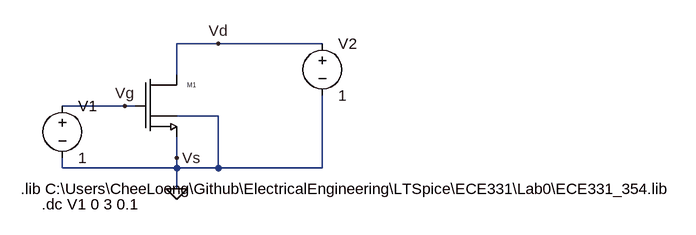
[diagram p0: schematic Lab0transistor.asc]
Lab0transistor.asc, the LTspice schematic file:
Version 4
SHEET 1 1120 680
WIRE 224 64 160 64
WIRE 384 64 224 64
WIRE 160 112 160 64
WIRE 80 160 -16 160
WIRE 96 160 80 160
WIRE 224 176 160 176
WIRE 160 240 160 208
WIRE -16 256 -16 240
WIRE 160 256 160 240
WIRE 160 256 -16 256
WIRE 224 256 224 176
WIRE 224 256 160 256
WIRE 384 256 384 144
WIRE 384 256 224 256
WIRE 160 288 160 256
FLAG 160 288 0
FLAG 224 64 Vd
FLAG 160 240 Vs
FLAG 80 160 Vg
SYMBOL ALD1101 96 112 R0
SYMATTR InstName M1
SYMATTR SpiceModel ""
SYMATTR SpiceLine ""
SYMATTR Value ALD1101
SYMATTR Value2 W=1.379e-3 L=1E-6
SYMBOL voltage -16 144 R0
WINDOW 123 0 0 Left 2
WINDOW 39 0 0 Left 2
SYMATTR InstName V1
SYMATTR Value 1
SYMBOL voltage 384 48 R0
WINDOW 123 0 0 Left 2
WINDOW 39 0 0 Left 2
SYMATTR InstName V2
SYMATTR Value 1
TEXT -48 312 Left 2 !.dc V1 0 3 0.1
TEXT -80 288 Left 2 !.lib C:\\Users\\CheeLoong\\Github\\ElectricalEngineering\\LTSpice\\ECE331\\Lab0\\ECE331_354.lib

The netlist it stands for:
* Lab0transistor.asc
M1 Vd Vg 0 0 ALD1101 W=1.379e-3 L=1E-6
V1 Vg 0 1
V2 Vd 0 1
.model NMOS NMOS
.model PMOS PMOS
.lib standard.mos
.dc V1 0 3 0.1
.lib C:\Users\CheeLoong\Github\ElectricalEngineering\LTSpice\ECE331\Lab0\ECE331_354.lib
.backanno
.end

* Results of the author's LTspice run, read from the files saved beside the schematic
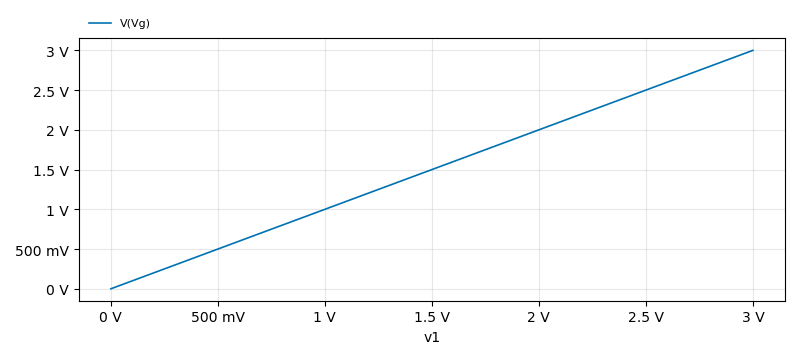
[diagram p1: DC transfer characteristic of Lab0transistor.asc, plotted from the saved traces]
* DC transfer characteristic, 1 run:
*   V(Vg): 0 V at v1=0 V, 3 V at v1=3 V, min 0 V, max 3 V